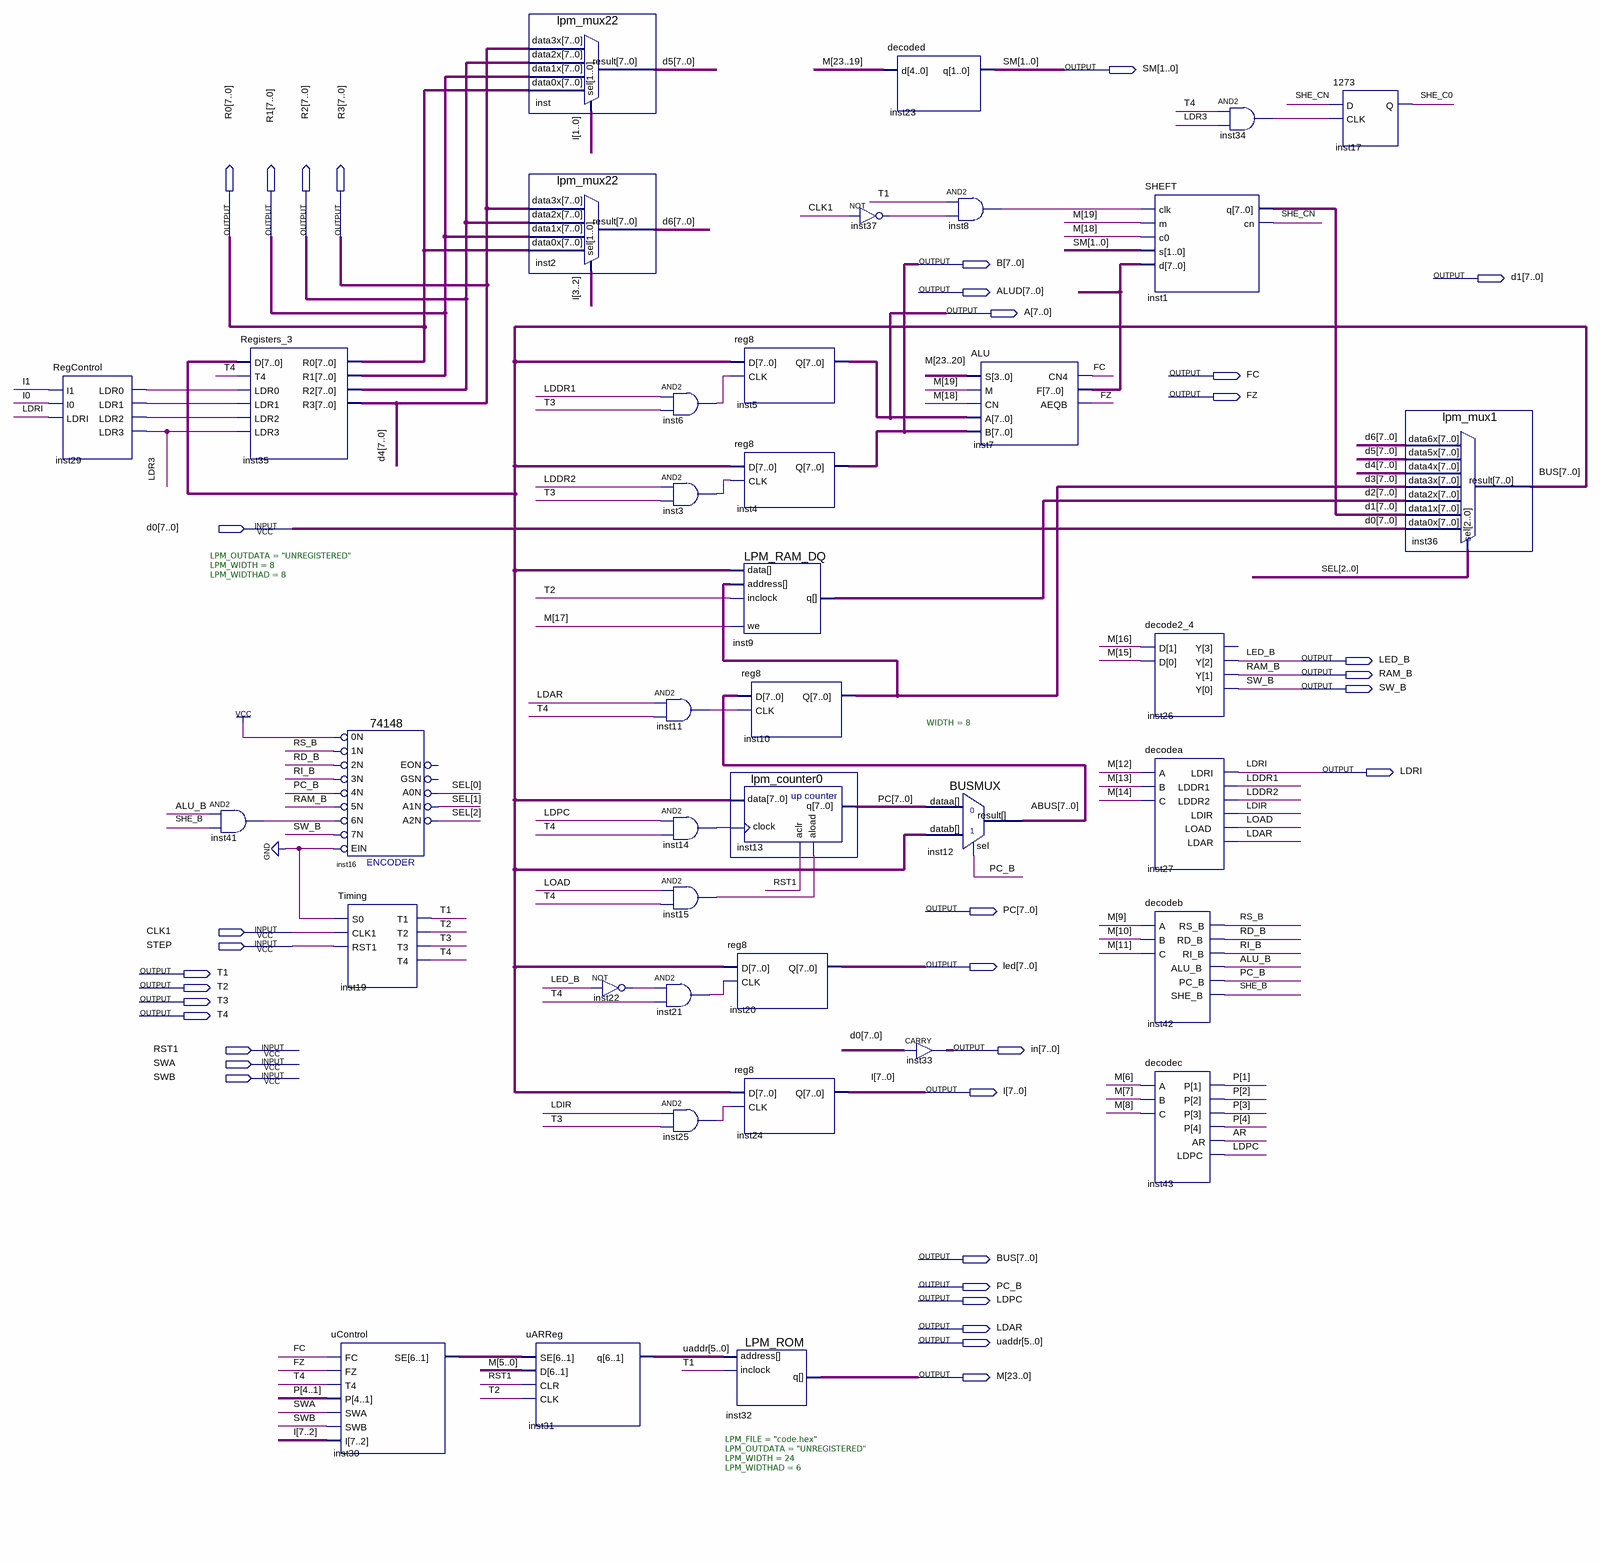
[diagram p0: schematic sheet]
// Quartus schematic Computer.bdf as structural Verilog: 39 symbols, 35 pins
module Computer (
  input  [7:0] d0,
  input  CLK1,
  input  STEP,
  input  RST1,
  input  SWA,
  input  SWB,
  output [1:0] SM,
  output [7:0] R0,
  output [7:0] R1,
  output [7:0] R2,
  output [7:0] R3,
  output [7:0] B,
  output [7:0] d1,
  output [7:0] ALUD,
  output [7:0] A,
  output FC,
  output FZ,
  output LED_B,
  output RAM_B,
  output SW_B,
  output LDRI,
  output [7:0] PC,
  output [7:0] led,
  output T1,
  output T2,
  output T3,
  output T4,
  output [7:0] in,
  output [7:0] I,
  output [7:0] BUS,
  output PC_B,
  output LDPC,
  output LDAR,
  output [5:0] uaddr,
  output [23:0] M
);

  wire ALU_B, AR, inst3_out, inst6_out, inst8_out, inst11_out, inst14_out, inst15_out, inst21_out,
       inst22_out, inst25_out, inst29_ldr0, inst29_ldr1, inst29_ldr2, inst34_out, inst37_out, inst41_out,
       LDDR1, LDDR2, LDIR, LDR3, LOAD, RD_B, RI_B, RS_B, SHE_B, SHE_C0, SHE_CN;
  wire [2:0] SEL;
  wire [4:1] P;
  wire [5:0] inst30_se;
  wire [7:0] ABUS, d2, d3, d5, d6, inst7_f;
  wire [3:0] inst26_y_open;  // unused outputs

  RegControl inst29 (
    .I1(I[1]), .I0(I[0]), .LDRI(LDRI), .LDR0(inst29_ldr0), .LDR1(inst29_ldr1), .LDR2(inst29_ldr2), .LDR3(LDR3));
  and inst41 (inst41_out, ALU_B, SHE_B);
  Registers_3 inst35 (
    .D(BUS), .T4(T4), .LDR0(inst29_ldr0), .LDR1(inst29_ldr1), .LDR2(inst29_ldr2), .LDR3(LDR3), .R0(R0),
    .R1(R1), .R2(R2), .R3(R3));
  \74148  inst16 (
    .\5N (RAM_B), .\0N (1'b1), .\1N (RS_B), .\2N (RD_B), .\3N (RI_B), .\4N (PC_B), .EIN(1'b0),
    .\6N (inst41_out), .\7N (SW_B), .A1N(SEL[1]), .A0N(SEL[0]), .A2N(SEL[2]));  // open: EON, GSN
  Timing inst19 (.S0(1'b0), .CLK1(CLK1), .RST1(STEP), .T1(T1), .T2(T2), .T3(T3), .T4(T4));
  uControl inst30 (.FC(FC), .FZ(FZ), .T4(T4), .P(P), .SWA(SWA), .SWB(SWB), .I(I[7:2]), .SE(inst30_se));
  lpm_mux22 inst (.data3x(R3), .data2x(R2), .data1x(R1), .data0x(R0), .sel(I[1:0]), .result(d5));
  lpm_mux22 inst2 (.data3x(R3), .data2x(R2), .data1x(R1), .data0x(R0), .sel(I[3:2]), .result(d6));
  uARReg inst31 (.SE(inst30_se), .D(M[5:0]), .CLR(RST1), .CLK(T2), .q(uaddr));
  not inst22 (inst22_out, LED_B);
  and inst6 (inst6_out, LDDR1, T3);
  and inst3 (inst3_out, LDDR2, T3);
  and inst11 (inst11_out, LDAR, T4);
  and inst14 (inst14_out, LDPC, T4);
  and inst15 (inst15_out, LOAD, T4);
  and inst21 (inst21_out, inst22_out, T4);
  and inst25 (inst25_out, LDIR, T3);
  reg8 inst20 (.D(BUS), .CLK(inst21_out), .Q(led));
  LPM_ROM #(.LPM_FILE("code.hex"), .LPM_OUTDATA("UNREGISTERED"), .LPM_WIDTH(24), .LPM_WIDTHAD(6)) inst32 (
    .address(uaddr), .inclock(T1), .q(M));
  reg8 inst5 (.D(BUS), .CLK(inst6_out), .Q(A));
  reg8 inst4 (.D(BUS), .CLK(inst3_out), .Q(B));
  LPM_RAM_DQ #(.LPM_OUTDATA("UNREGISTERED"), .LPM_WIDTH(8), .LPM_WIDTHAD(8)) inst9 (
    .inclock(T2), .data(BUS), .address(d3), .we(M[17]), .q(d2));
  reg8 inst10 (.D(ABUS), .CLK(inst11_out), .Q(d3));
  lpm_counter0 inst13 (.data(BUS), .clock(inst14_out), .aclr(RST1), .aload(inst15_out), .q(PC));
  reg8 inst24 (.D(BUS), .CLK(inst25_out), .Q(I));
  decoded inst23 (.d(M[23:19]), .q(SM));
  not inst37 (inst37_out, CLK1);
  and inst8 (inst8_out, T1, inst37_out);
  BUSMUX #(.WIDTH(8)) inst12 (.datab(BUS), .sel(PC_B), .dataa(PC), .result(ABUS));
  CARRY inst33[7:0] (.IN(d0), .OUT(in));
  ALU inst7 (.S(M[23:20]), .M(M[19]), .CN(M[18]), .A(A), .B(B), .CN4(FC), .F(inst7_f), .AEQB(FZ));
  SHEFT inst1 (.clk(inst8_out), .m(M[19]), .c0(M[18]), .s(SM), .d(inst7_f), .q(d1), .cn(SHE_CN));
  decode2_4 inst26 (.D(M[16:15]), .Y({inst26_y_open[3], LED_B, RAM_B, SW_B}));
  decodea inst27 (
    .A(M[12]), .B(M[13]), .C(M[14]), .LDRI(LDRI), .LDDR1(LDDR1), .LDDR2(LDDR2), .LDIR(LDIR), .LOAD(LOAD),
    .LDAR(LDAR));
  decodeb inst42 (
    .A(M[9]), .B(M[10]), .C(M[11]), .RS_B(RS_B), .RD_B(RD_B), .RI_B(RI_B), .ALU_B(ALU_B), .PC_B(PC_B),
    .SHE_B(SHE_B));
  decodec inst43 (.A(M[6]), .B(M[7]), .C(M[8]), .P(P), .AR(AR), .LDPC(LDPC));
  and inst34 (inst34_out, T4, LDR3);
  \1273  inst17 (.CLK(inst34_out), .D(SHE_CN), .Q(SHE_C0));
  lpm_mux1 inst36 (
    .data6x(d6), .data5x(d5), .data4x(R3), .data3x(d3), .data2x(d2), .data1x(d1), .data0x(d0), .sel(SEL),
    .result(BUS));

  // Other names for the same wires on the sheet: d4[7:0] = R3
endmodule
